# Altium schematic sheet SCH.SchDoc
size A3; PageSetup: Record=PageOptions|CenterHorizontal=True|CenterVertical=True|PrintScale=0.73|XCorrection=1.00|YCorrection=1.00|PrintKind=1|BorderSize=5000000|LeftOffset=0|BottomOffset=0|Orientation=2|PaperLength=2970|PaperWidth=2100|Scale=100|PaperSource=7|PrintQuality=2400|MediaType=1|DitherType=10|PaperKind=A4|PrintScaleMode=1
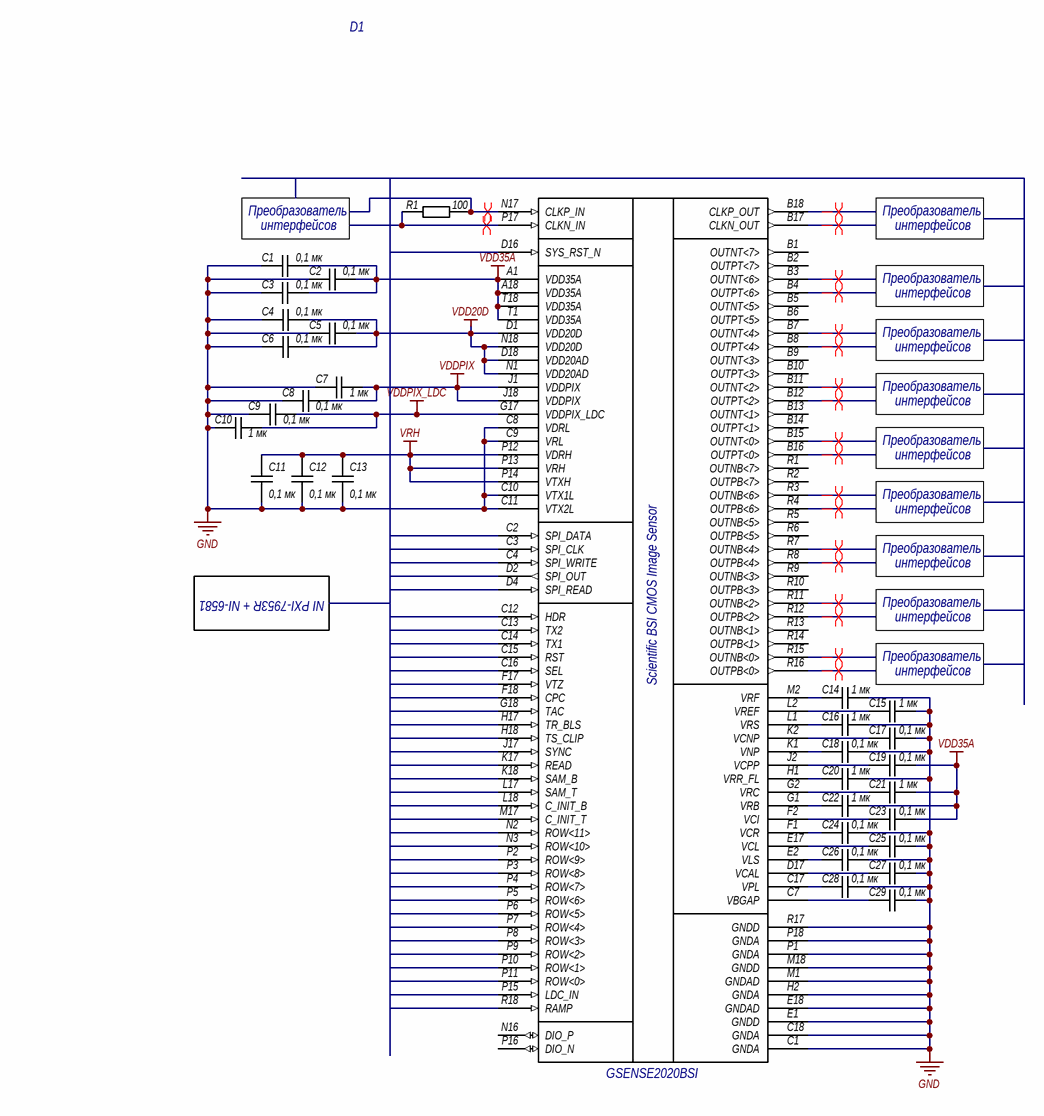
[diagram p0: SCH.SchDoc]

## Parts
C1  0,1 мк
C2  0,1 мк
C3  0,1 мк
C4  0,1 мк
C5  0,1 мк
C6  0,1 мк
C7  1 мк
C8  0,1 мк
C9  0,1 мк
C10  1 мк
C11  0,1 мк
C12  0,1 мк
C13  0,1 мк
C14  1 мк
C15  1 мк
C16  1 мк
C17  0,1 мк
C18  0,1 мк
C19  0,1 мк
C20  1 мк
C21  1 мк
C22  1 мк
C23  0,1 мк
C24  0,1 мк
C25  0,1 мк
C26  0,1 мк
C27  0,1 мк
C28  0,1 мк
C29  0,1 мк
D1  GSENSE2020BSI  [GSENSE2020BSI]
R1  100  [RES]

## Nets
GND: C1.2 C2.2 C3.2 C4.2 C5.2 C6.2 C7.2 C8.2 C9.2 C10.2 C11.1 C12.1 C13.1 C14.2 C15.2 C16.2 C17.2 C18.2 C20.2 C24.2 C25.2 C26.2 C27.2 C28.2 C29.2 D1.C1(GNDA) D1.C8(VDRL) D1.C9(VRL) D1.C10(VTX1L) D1.C11(VTX2L) D1.C18(GNDA) D1.E1(GNDD) D1.E18(GNDAD) D1.H2(GNDA) D1.M1(GNDAD) D1.M18(GNDD) D1.P1(GNDA) D1.P18(GNDA) D1.R17(GNDD)
VDD20D: C4.1 C5.1 C6.1 D1.D1(VDD20D) D1.D18(VDD20AD) D1.N1(VDD20AD) D1.N18(VDD20D)
VDD35A: C1.1 C2.1 C3.1 C19.2 C21.2 C22.2 C23.2 D1.A1(VDD35A) D1.A18(VDD35A) D1.T1(VDD35A) D1.T18(VDD35A)
VDDPIX: C7.1 C8.1 D1.J1(VDDPIX) D1.J18(VDDPIX)
VDDPIX_LDC: C9.1 C10.1 D1.G17(VDDPIX_LDC)
VRH: C11.2 C12.2 C13.2 D1.P12(VDRH) D1.P13(VRH) D1.P14(VTXH)
NetC14_1: C14.1 D1.M2(VRF)
NetC15_1: C15.1 D1.L2(VREF)
NetC16_1: C16.1 D1.L1(VRS)
NetC17_1: C17.1 D1.K2(VCNP)
NetC18_1: C18.1 D1.K1(VNP)
NetC19_1: C19.1 D1.J2(VCPP)
NetC20_1: C20.1 D1.H1(VRR_FL)
NetC21_1: C21.1 D1.G2(VRC)
NetC22_1: C22.1 D1.G1(VRB)
NetC23_1: C23.1 D1.F2(VCI)
NetC24_1: C24.1 D1.F1(VCR)
NetC25_1: C25.1 D1.E17(VCL)
NetC26_1: C26.1 D1.E2(VLS)
NetC27_1: C27.1 D1.D17(VCAL)
NetC28_1: C28.1 D1.C17(VPL)
NetC29_1: C29.1 D1.C7(VBGAP)
NetD1_N17: D1.N17(CLKP_IN) R1.1
NetD1_P17: D1.P17(CLKN_IN) R1.2

Not connected (* = marked no-connect by the designer): D1 B1(OUTNT<7>) B2(OUTPT<7>) B3(OUTNT<6>) B4(OUTPT<6>) B5(OUTNT<5>) B6(OUTPT<5>) B7(OUTNT<4>) B8(OUTPT<4>) B9(OUTNT<3>) B10(OUTPT<3>) B11(OUTNT<2>) B12(OUTPT<2>) B13(OUTNT<1>) B14(OUTPT<1>) B15(OUTNT<0>) B16(OUTPT<0>) B17(CLKN_OUT) B18(CLKP_OUT) C2(SPI_DATA) C3(SPI_CLK) C4(SPI_WRITE) C12(HDR) C13(TX2) C14(TX1) C15(RST) C16(SEL) D2(SPI_OUT) D4(SPI_READ) D16(SYS_RST_N) F17(VTZ) F18(CPC) G18(TAC) H17(TR_BLS) H18(TS_CLIP) J17(SYNC) K17(READ) K18(SAM_B) L17(SAM_T) L18(C_INIT_B) M17(C_INIT_T) N2(ROW<11>) N3(ROW<10>) N16(DIO_P) P2(ROW<9>) P3(ROW<8>) P4(ROW<7>) P5(ROW<6>) P6(ROW<5>) P7(ROW<4>) P8(ROW<3>) P9(ROW<2>) P10(ROW<1>) P11(ROW<0>) P15(LDC_IN) P16(DIO_N) R1(OUTNB<7>) R2(OUTPB<7>) R3(OUTNB<6>) R4(OUTPB<6>) R5(OUTNB<5>) R6(OUTPB<5>) R7(OUTNB<4>) R8(OUTPB<4>) R9(OUTNB<3>) R10(OUTPB<3>) R11(OUTNB<2>) R12(OUTPB<2>) R13(OUTNB<1>) R14(OUTPB<1>) R15(OUTNB<0>) R16(OUTPB<0>) R18(RAMP)

## Layout directives
differential pair: NetD1_B3, NetD1_B4, NetD1_B7, NetD1_B8, NetD1_B11, NetD1_B12, NetD1_B15, NetD1_B16, NetD1_B17, NetD1_B18, NetD1_N17, NetD1_P17, NetD1_R3, NetD1_R4, NetD1_R7, NetD1_R8, NetD1_R11, NetD1_R12, NetD1_R15, NetD1_R16

## Notes on the sheet
- Преобразователь
- интерфейсов
- NI PXI-7953R + NI-6581
- (near D1) Scientific BSI CMOS Image Sensor

## Library data of the parts
C1-C29 = Cap: Capacitor
R1 = Res: Resistor